# EasyEDA Pro project EasyEDA.epro, schematic Schematic1

## Sheets
1 P1: Board Name: Board1; Create Date: 2025-09-26; Page Name: P1; Project Name: V3s_SBC; Schematic Name: Schematic1; Update Date: 2025-11-04; Company: EasyEDA.com; Page Size: A4; Version: V1.0
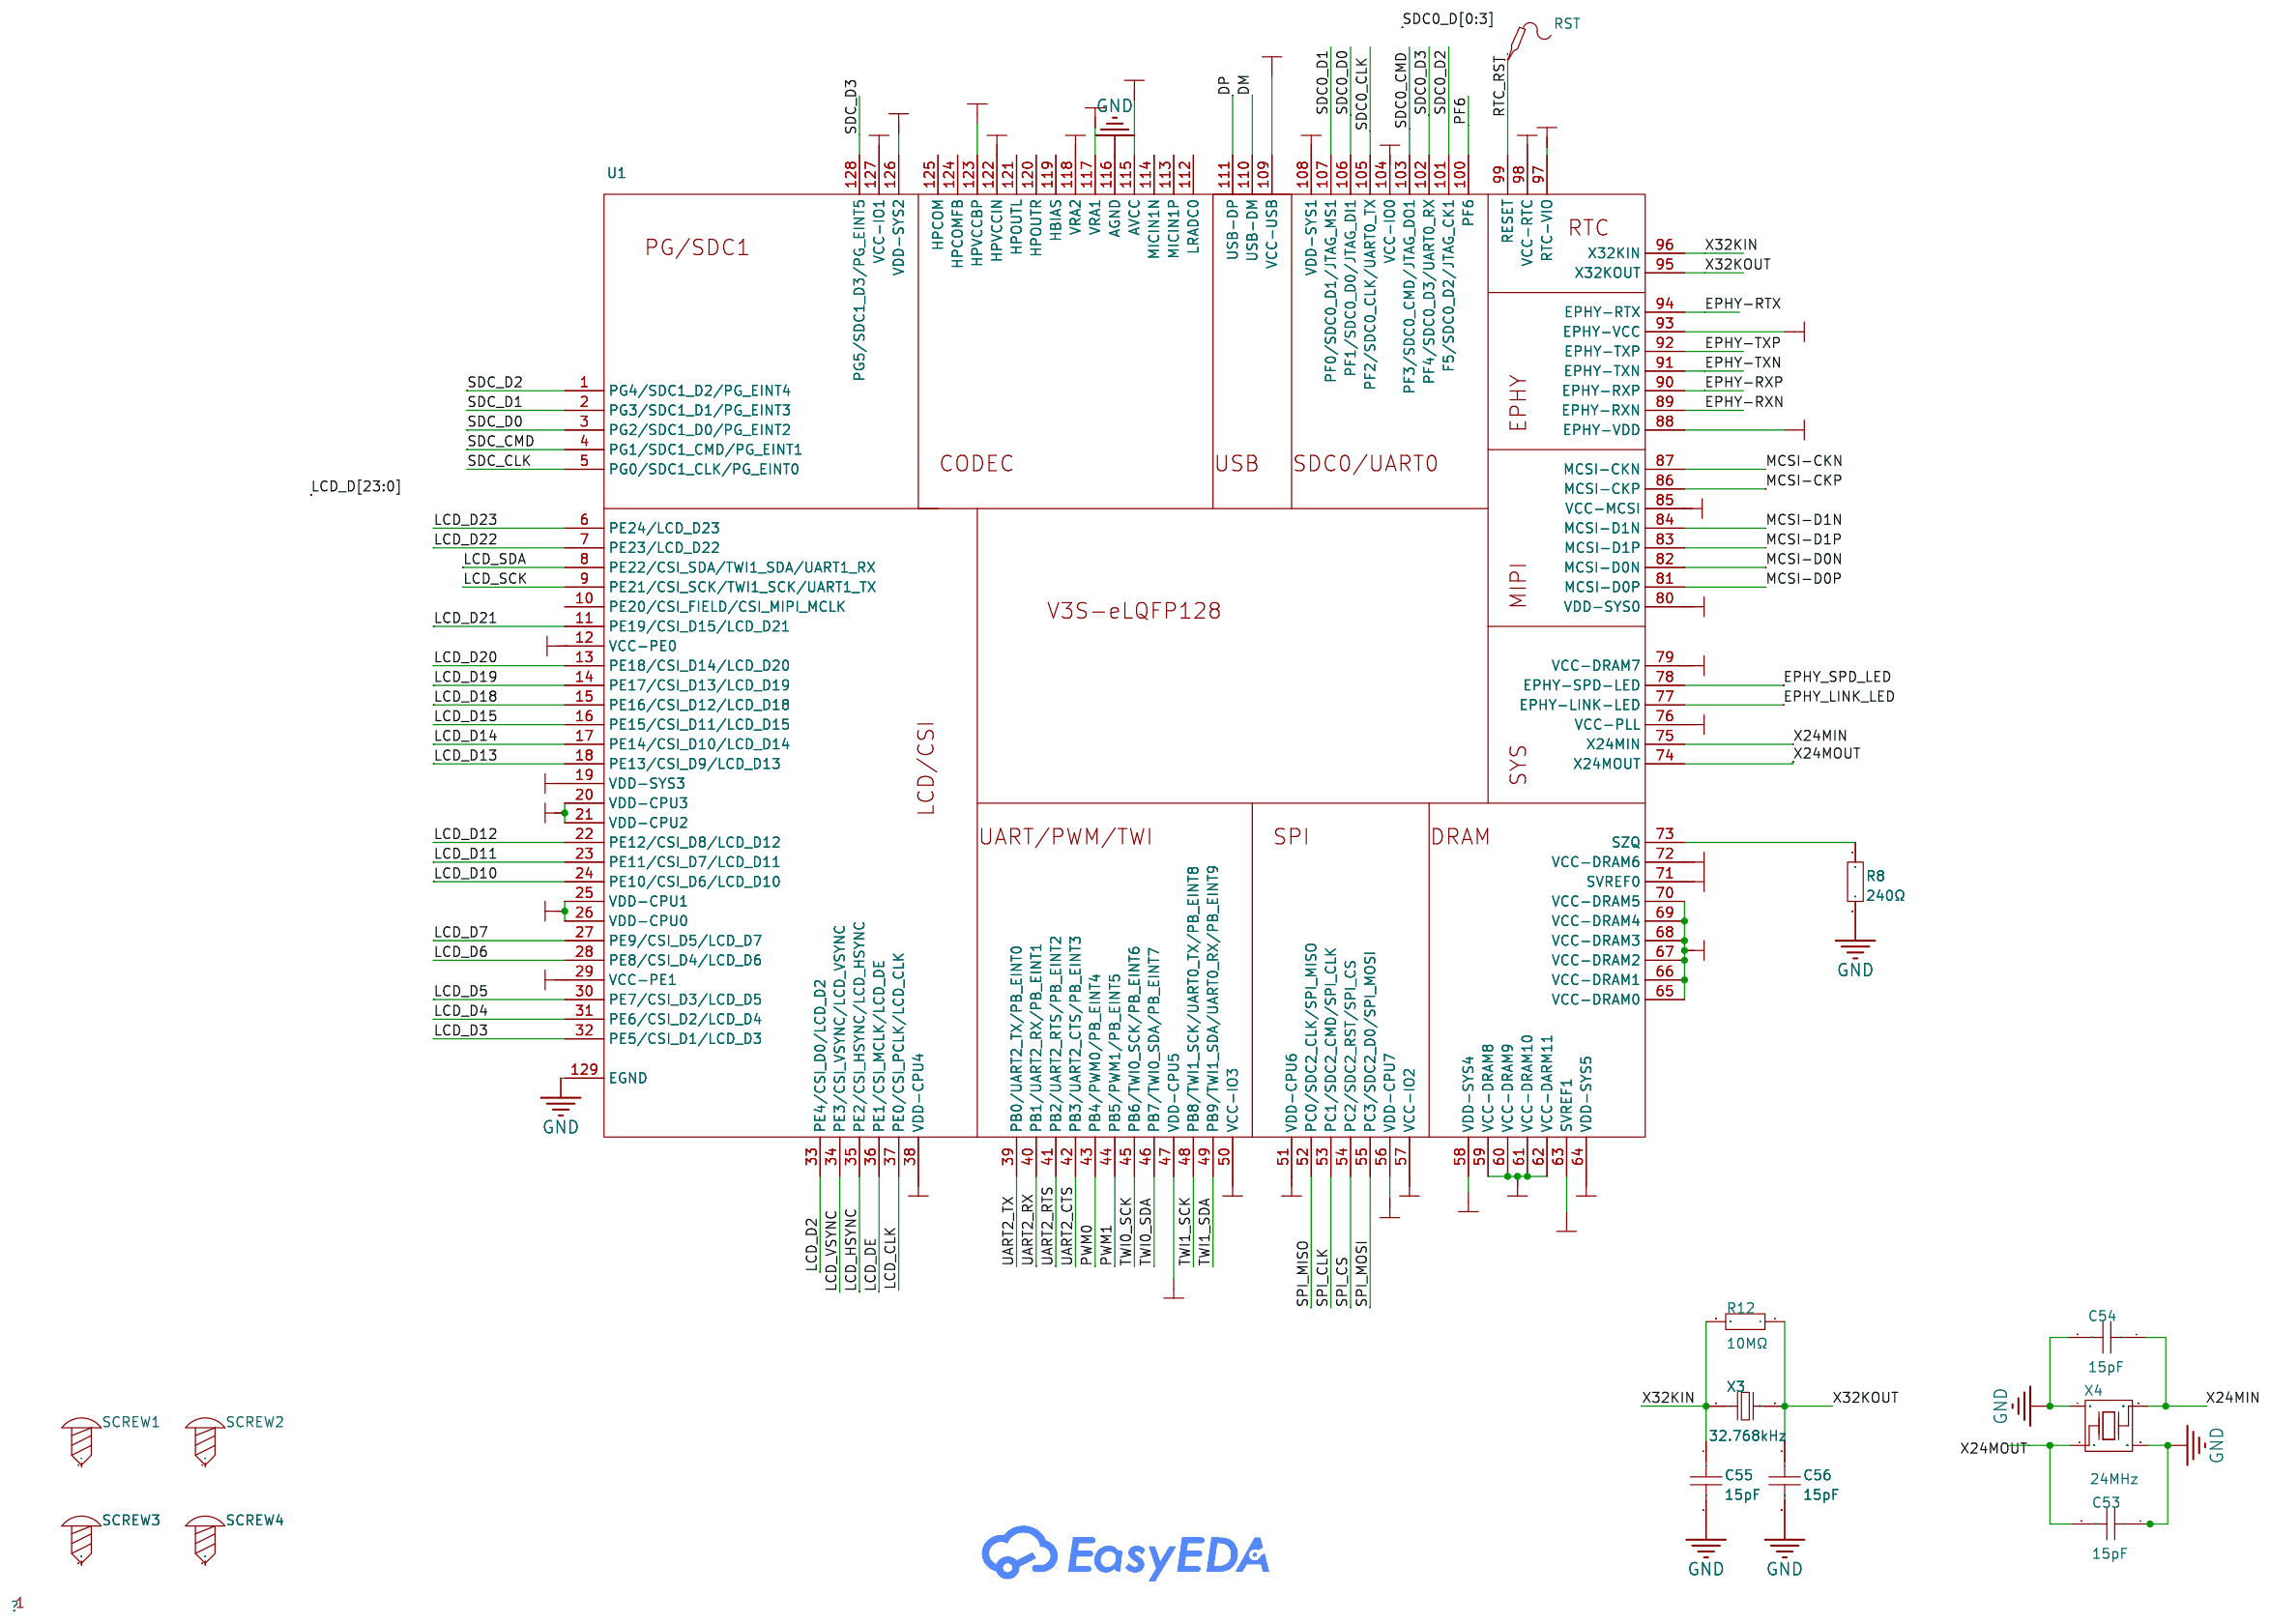
[diagram p0: P1]
2 POWER: Page Name: POWER; Update Date: 2025-11-14
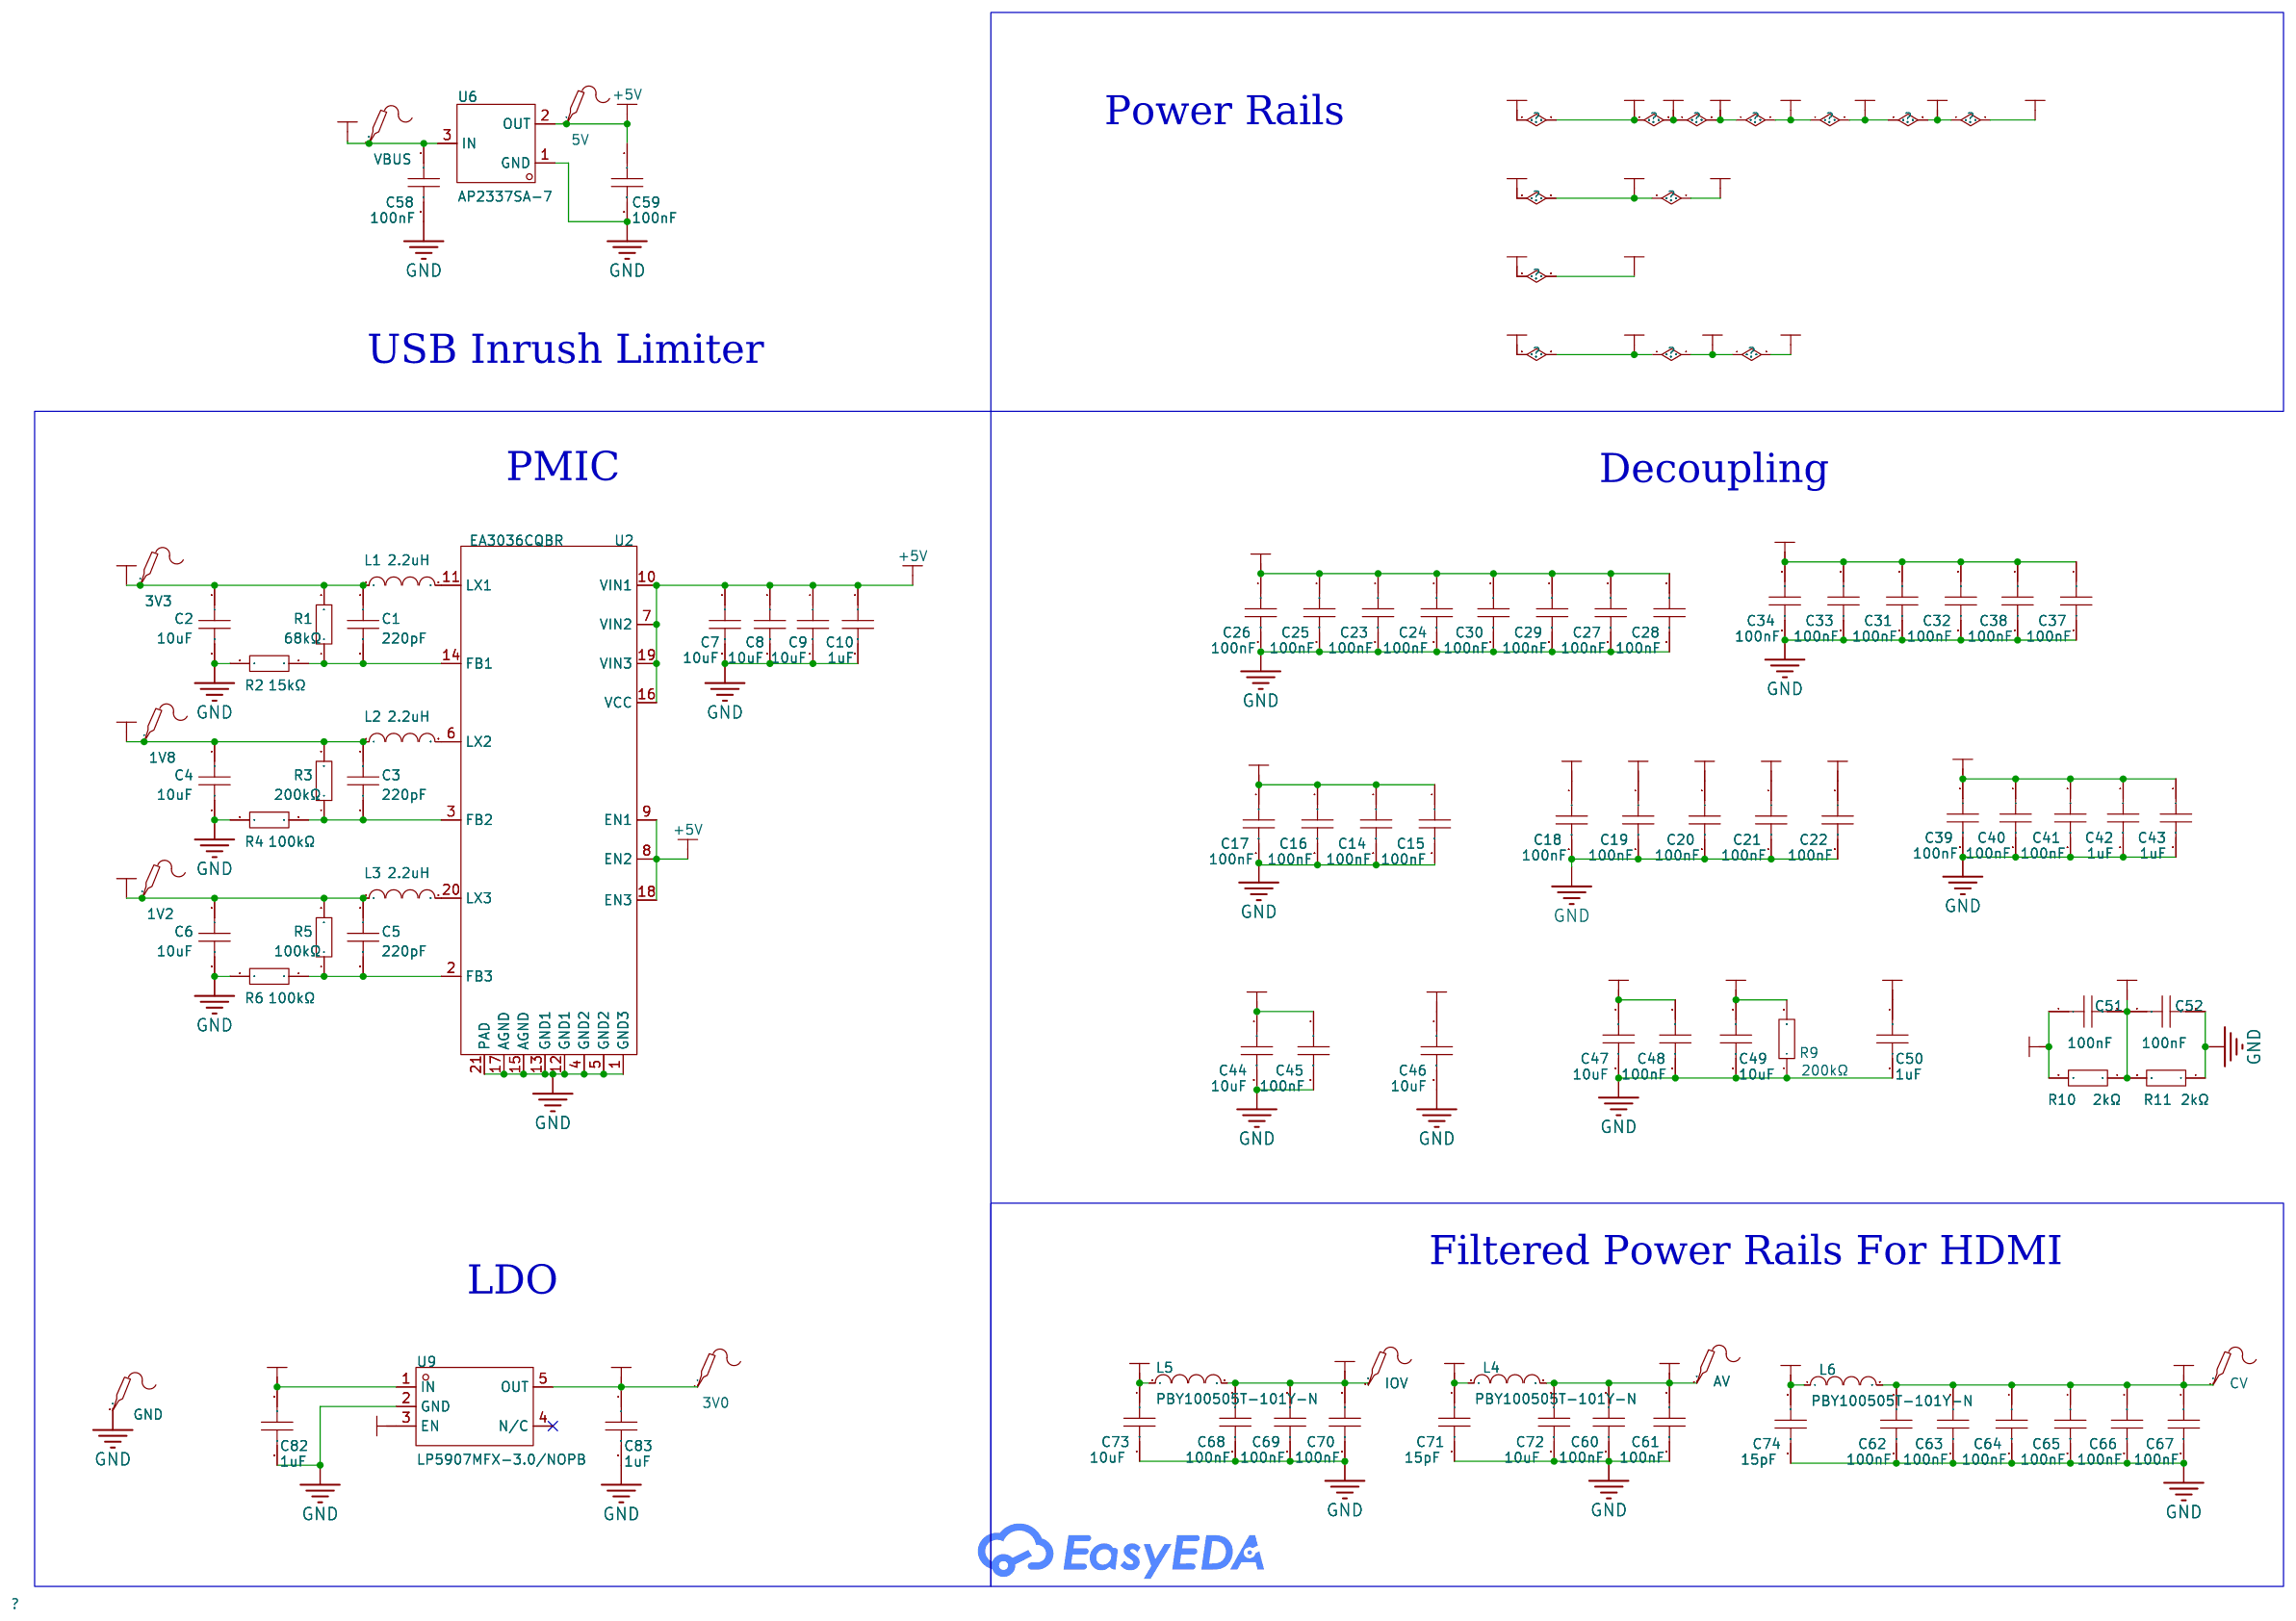
[diagram p1: POWER]
3 PERIPHERALS: Create Date: 2025-10-03; Page Name: PERIPHERALS
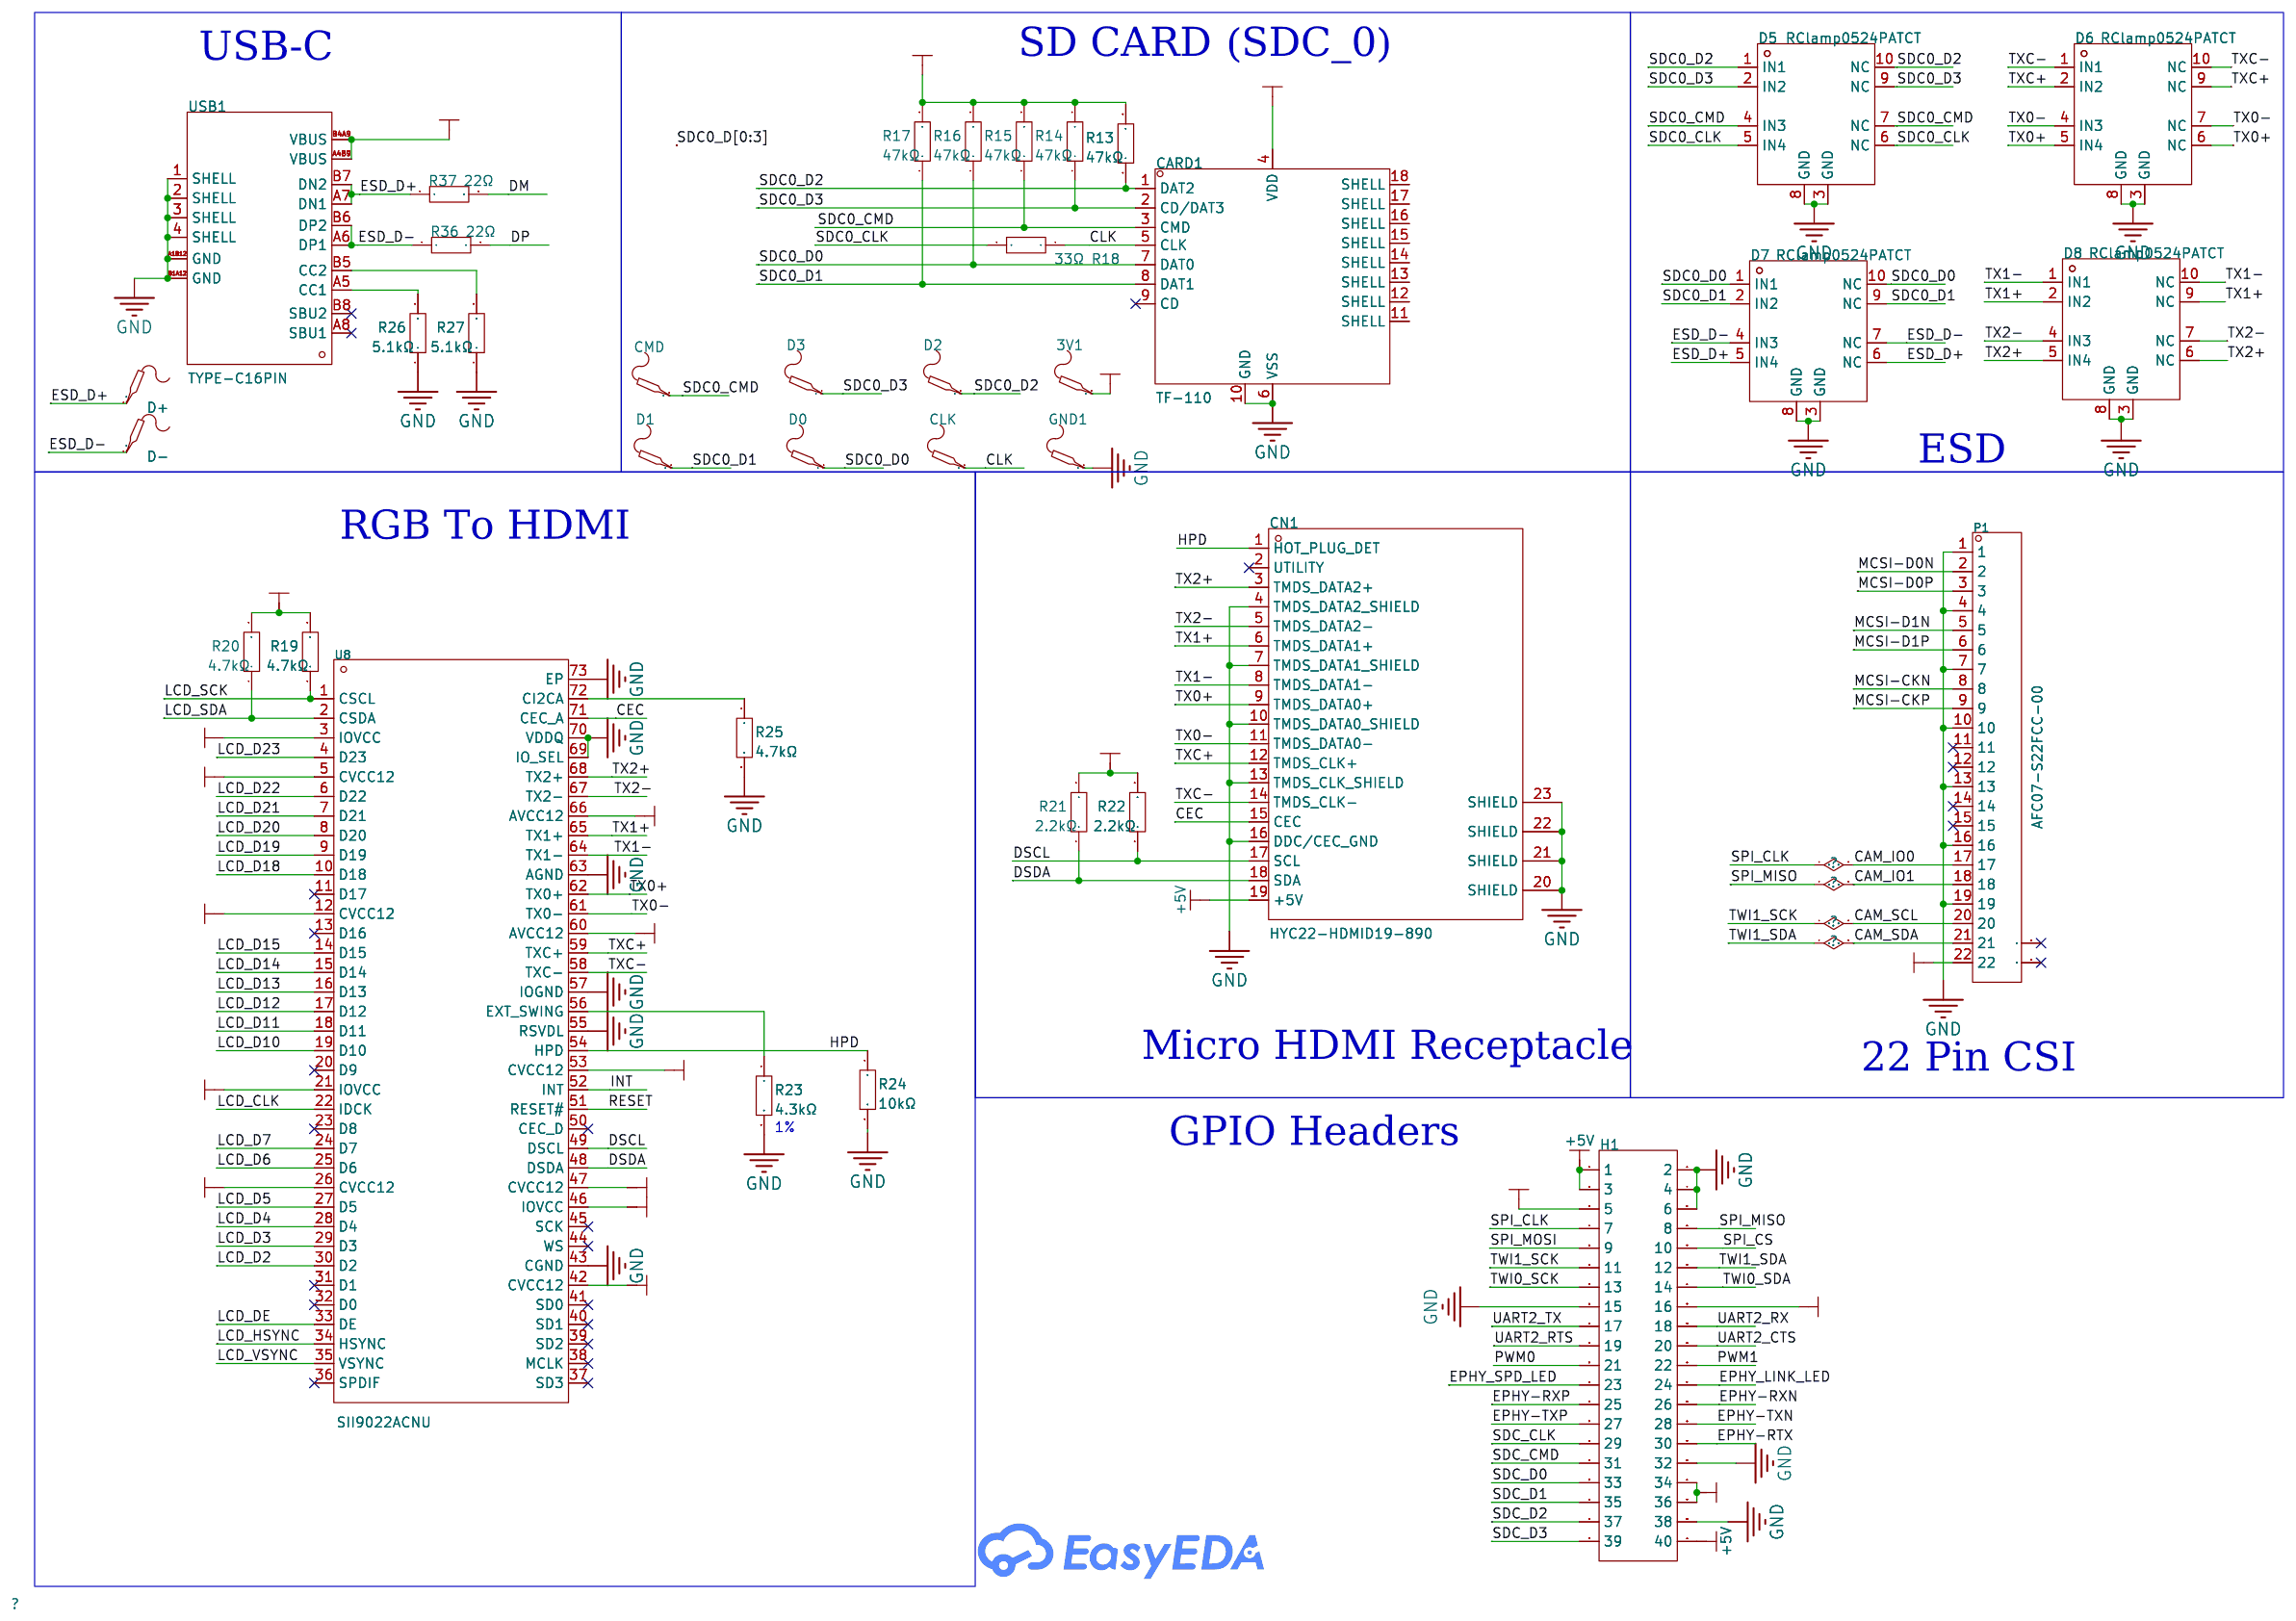
[diagram p2: PERIPHERALS]

## Parts
sheet P1
C53  15pF  [C0201]
C54  15pF  [C0201]
C55  15pF  [C0201]
C56  15pF  [C0201]
R8  240Ω  [R0201]
R12  10MΩ  [R0201]
RST  -  [Test-Point-0.5mm]  (no BOM)
SCREW1  -  [Screw-Hole-M2]  (no BOM)
SCREW2  -  [Screw-Hole-M2]  (no BOM)
SCREW3  -  [Screw-Hole-M2]  (no BOM)
SCREW4  -  [Screw-Hole-M2]  (no BOM)
U1  V3s  [LQFP-128_L14.0-W14.0-P0.40-LS16.0-BL-EP5.0]
X3  32.768kHz  [FC-12M_L2.0-W1.2]
X4  24MHz  [CRYSTAL-SMD_4P-L1.6-W1.2-BL]
sheet PERIPHERALS
3V1  -  [Test-Point-0.5mm]  (no BOM)
CARD1  TF-110  [TF-SMD_TF-110]
CLK  -  [Test-Point-0.5mm]  (no BOM)
CMD  -  [Test-Point-0.5mm]  (no BOM)
CN1  HYC22-HDMID19-890  [HDMI-SMD_HYC22-HDMID19-890]
D0  -  [Test-Point-0.5mm]  (no BOM)
D1  -  [Test-Point-0.5mm]  (no BOM)
D2  -  [Test-Point-0.5mm]  (no BOM)
D3  -  [Test-Point-0.5mm]  (no BOM)
D5  RClamp0524PATCT  [SLP2510P8_L2.5-W1.0-P0.50-BL]
D6  RClamp0524PATCT  [SLP2510P8_L2.5-W1.0-P0.50-BL]
D7  RClamp0524PATCT  [SLP2510P8_L2.5-W1.0-P0.50-BL]
D8  RClamp0524PATCT  [SLP2510P8_L2.5-W1.0-P0.50-BL]
D+  -  [Test-Point-0.5mm]  (no BOM)
D-  -  [Test-Point-0.5mm]  (no BOM)
GND1  -  [Test-Point-0.5mm]  (no BOM)
H1  2.54mm 2*20P直排针  [HDR-TH_40P-P2.54-V-M-R2-C20-S2.54]
P1  AFC07-S22FCC-00  [FPC-SMD_AFC07-S22FCC-00]
R13  47kΩ  [R0201]
R14  47kΩ  [R0201]
R15  47kΩ  [R0201]
R16  47kΩ  [R0201]
R17  47kΩ  [R0201]
R18  33Ω  [R0201]
R19  4.7kΩ  [R0201]
R20  4.7kΩ  [R0201]
R21  2.2kΩ  [R0201]
R22  2.2kΩ  [R0201]
R23  4.3kΩ  [R0201]
R24  10kΩ  [R0201]
R25  4.7kΩ  [R0201]
R26  5.1kΩ  [R0201]
R27  5.1kΩ  [R0201]
R36  22Ω  [R0201]
R37  22Ω  [R0201]
U8  SII9022ACNU  [QFN-72_L10.0-W10.0-P0.50-BL-EP]
USB1  TYPE-C16PIN  [USB-C-SMD_TYPE-C16PIN]
sheet POWER
1V2  -  [Test-Point-0.5mm]  (no BOM)
1V8  -  [Test-Point-0.5mm]  (no BOM)
3V0  -  [Test-Point-0.5mm]  (no BOM)
3V3  -  [Test-Point-0.5mm]  (no BOM)
5V  -  [Test-Point-0.5mm]  (no BOM)
AV  -  [Test-Point-0.5mm]  (no BOM)
C1  220pF  [C0201]
C2  10uF  [C0402]
C3  220pF  [C0201]
C4  10uF  [C0402]
C5  220pF  [C0201]
C6  10uF  [C0402]
C7  10uF  [C0402]
C8  10uF  [C0402]
C9  10uF  [C0402]
C10  1uF  [C0201]
C14  100nF  [C0201]
C15  100nF  [C0201]
C16  100nF  [C0201]
C17  100nF  [C0201]
C18  100nF  [C0201]
C19  100nF  [C0201]
C20  100nF  [C0201]
C21  100nF  [C0201]
C22  100nF  [C0201]
C23  100nF  [C0201]
C24  100nF  [C0201]
C25  100nF  [C0201]
C26  100nF  [C0201]
C27  100nF  [C0201]
C28  100nF  [C0201]
C29  100nF  [C0201]
C30  100nF  [C0201]
C31  100nF  [C0201]
C32  100nF  [C0201]
C33  100nF  [C0201]
C34  100nF  [C0201]
C37  100nF  [C0201]
C38  100nF  [C0201]
C39  100nF  [C0201]
C40  100nF  [C0201]
C41  100nF  [C0201]
C42  1uF  [C0201]
C43  1uF  [C0201]
C44  10uF  [C0402]
C45  100nF  [C0201]
C46  10uF  [C0402]
C47  10uF  [C0402]
C48  100nF  [C0201]
C49  10uF  [C0402]
C50  1uF  [C0201]
C51  100nF  [C0201]
C52  100nF  [C0201]
C58  100nF  [C0201]
C59  100nF  [C0201]
C60  100nF  [C0201]
C61  100nF  [C0201]
C62  100nF  [C0201]
C63  100nF  [C0201]
C64  100nF  [C0201]
C65  100nF  [C0201]
C66  100nF  [C0201]
C67  100nF  [C0201]
C68  100nF  [C0201]
C69  100nF  [C0201]
C70  100nF  [C0201]
C71  15pF  [C0201]
C72  10uF  [C0402]
C73  10uF  [C0402]
C74  15pF  [C0201]
C82  1uF  [C0201]
C83  1uF  [C0201]
CV  -  [Test-Point-0.5mm]  (no BOM)
GND  -  [Test-Point-0.5mm]  (no BOM)
IOV  -  [Test-Point-0.5mm]  (no BOM)
L1  2.2uH  [IND-SMD_L2.0-W1.2_FTC201210S]
L2  2.2uH  [IND-SMD_L2.0-W1.2_FTC201210S]
L3  2.2uH  [IND-SMD_L2.0-W1.2_FTC201210S]
L4  PBY100505T-101Y-N  [L0402]
L5  PBY100505T-101Y-N  [L0402]
L6  PBY100505T-101Y-N  [L0402]
R1  68kΩ  [R0201]
R2  15kΩ  [R0201]
R3  200kΩ  [R0201]
R4  100kΩ  [R0201]
R5  100kΩ  [R0201]
R6  100kΩ  [R0201]
R9  200kΩ  [R0201]
R10  2kΩ  [R0201]
R11  2kΩ  [R0201]
U2  EA3036CQBR  [WQFN-20_L3.0-W3.0-P0.40-BL-EP]
U6  AP2337SA-7  [SOT-23-3_L2.9-W1.3-P1.90-LS2.4-BR]
U9  LP5907MFX-3.0/NOPB  [SOT-23-5_L3.0-W1.7-P0.95-LS2.8-BL]
VBUS  -  [Test-Point-0.5mm]  (no BOM)

## Library data of the parts
C53-C56 C71 C74 = GRM0335C1H150JA01D: Capacitance:15pF Tolerance:±5% Tolerance:±5% Voltage Rating:50V Temperature Coefficient:C0G; LCSC Part Name: 15pF ±5% 50V; Supplier Part: C85891; Manufacturer: muRata(村田); Supplier Footprint: 0201; JLCPCB Part Class: Extended Part; Datasheet: https://item.szlcsc.com/datasheet/GRM0335C1H150JA01D/87067.html; Supplier: LCSC; Tolerance: ±5%; Voltage Rating: 50V; Temperature Coefficient: C0G
R8 = 0201WMF2400TEE: Type:Thick Film Resistor Resistance:240Ω Tolerance:±1% Tolerance:±1% Power(Watts):50mW Voltage-Supply(Max):25V Temperature Coefficient:±200ppm/℃ Temperature Coefficient:±200ppm/℃ Operating Temperature:-55℃~+155℃ Operating Temperature:-55℃~+155℃; LCSC Part Name: 240Ω ±1% 50mW 厚膜电阻; Supplier Part: C270354; Manufacturer: UNI-ROYAL(厚声); Supplier Footprint: 0201; JLCPCB Part Class: Extended Part; Datasheet: https://item.szlcsc.com/datasheet/0201WMF2400TEE/259884.html; Supplier: LCSC; Type: Thick Film Resistor; Tolerance: ±1%; Power(Watts): 50mW; Voltage-Supply(Max): 25V; Temperature Coefficient: ±200ppm/℃; Operating Temperature: -55℃~+155℃
R12 = 0201WMF1005TEE: Type:Thick Film Resistor Resistance:10MΩ Tolerance:±1% Tolerance:±1% Power(Watts):50mW Voltage-Supply(Max):25V Temperature Coefficient:±200ppm/℃ Temperature Coefficient:±200ppm/℃ Operating Temperature:-55℃~+155℃ Operating Temperature:-55℃~+155℃; LCSC Part Name: 10MΩ ±1% 50mW 厚膜电阻; Supplier Part: C423797; Manufacturer: UNI-ROYAL(厚声); Supplier Footprint: 0201; JLCPCB Part Class: Extended Part; Datasheet: https://item.szlcsc.com/datasheet/0201WMF1005TEE/416747.html; Supplier: LCSC; Type: Thick Film Resistor; Tolerance: ±1%; Power(Watts): 50mW; Voltage-Supply(Max): 25V; Temperature Coefficient: ±200ppm/℃; Operating Temperature: -55℃~+155℃
1V2 1V8 3V0 3V1 3V3 5V AV CLK CMD CV D0-D3 D+ D- GND GND1 IOV RST VBUS = Test-Point: Test Point 测试点
SCREW1-SCREW4 = Screw-Hole-M2: Supplier Footprint: 插件
U1 = V3s: CPU Core:-; LCSC Part Name: Allwinner V3s; Supplier Part: C2687449; Manufacturer: Allwinner(全志); Supplier Footprint: LQFP-128-EP(14x14); Supplier: LCSC
X3 = X1A0000610002: Type:Crystal Oscillator Frequency:32.768kHz Normal temperature Frequency Tolerance:±20ppm Normal temperature Frequency Tolerance:±20ppm Load Capacitance:12.5pF Equivalent Series Resistance(ESR):90kΩ Operating Temperature:-40℃~+85℃ Operating Temperature:-4; LCSC Part Name: 32.768kHz ±20ppm 12.5pF; Supplier Part: C55208; Manufacturer: EPSON(爱普生); Supplier Footprint: SMD2012-2P; Datasheet: https://item.szlcsc.com/datasheet/X1A0000610002/56234.html; Supplier: LCSC; Type: Crystal Oscillator; Normal temperature Frequency Tolerance: ±20ppm; Load Capacitance: 12.5pF; Equivalent Series Resistance(ESR): 90kΩ; Operating Temperature: -40℃~+85℃
X4 = 7R24000E12UBE: Type:Crystal Oscillator Frequency:24MHz Normal temperature Frequency Tolerance:±10ppm Normal temperature Frequency Tolerance:±10ppm Load Capacitance:12pF Frequency Stability:±30ppm Frequency Stability:±30ppm Operating Temperature:-20℃~+70℃ Operating Tempe; LCSC Part Name: 24MHz ±10ppm 12pF; Supplier Part: C252278; Manufacturer: SJK(晶科鑫); Supplier Footprint: SMD1612-4P; JLCPCB Part Class: Extended Part; Datasheet: https://item.szlcsc.com/datasheet/7R24000E12UBE/247453.html; Supplier: LCSC; Type: Crystal Oscillator; Normal temperature Frequency Tolerance: ±10ppm; Load Capacitance: 12pF; Frequency Stability: ±30ppm; Operating Temperature: -20℃~+70℃
CARD1 = TF-110: Card Connection Mode:Push-Pull Card Type:MicroSD Card (TF Card) Connector Type:Connector and Ejector Additional Card Detection Pins:- Supplementary Features:- Height Above Board:1.32mm Operating Temperature:-45℃~+85℃ Operating Temperature:-45℃~+85℃; LCSC Part Name: 拔插式 MicroSD卡(TF卡) 卡座; Supplier Part: C266613; Manufacturer: XUNPU(讯普); Supplier Footprint: SMD; Datasheet: https://item.szlcsc.com/datasheet/TF-110/256968.html; Supplier: LCSC; Card Connection Mode: Push-Pull; Card Type: MicroSD Card (TF Card); Connector Type: Connector and Ejector; Height Above Board: 1.32mm; Operating Temperature: -45℃~+85℃
CN1 = HYC22-HDMID19-890: Connector Type:HDMI-D Gender:Mother Number of Pins:19P Mounting Style:Horizontal attachment Current Rating (Max):0.5A Rated Voltage (Max):40V Operating Temperature Range:-20℃~+85℃ Operating Temperature Range:-20℃~+85℃; Supplier Part: C711356; Manufacturer: 华宇创; Supplier Footprint: SMD; Datasheet: https://atta.szlcsc.com/upload/public/pdf/source/20200812/C711356_796A915A627521E4742B63608531C3C9.pdf; Supplier: LCSC; Connector Type: HDMI-D; Gender: Mother; Number of Pins: 19P; Mounting Style: Horizontal attachment; Current Rating (Max): 0.5A; Rated Voltage (Max): 40V; Operating Temperature Range: -20℃~+85℃
D5-D8 = RClamp0524PATCT_C40960: Reverse Stand-Off Voltage (Vrwm):5V Clamping Voltage:15V Peak Pulse Current (Ipp):5A@8/20us Peak Pulse Power Dissipation (Ppp):150W Voltage - Breakdown:6V Reverse Leakage Current (Ir):1uA Number of Channels:4 Operating Temperature:-55℃~+125℃@(Tj) Operatin; LCSC Part Name: ESD 5V截止 峰值浪涌电流：5A@8/20us; Supplier Part: C40960; Manufacturer: SEMTECH; Supplier Footprint: DFN-10(1x2.5); JLCPCB Part Class: Extended Part; Datasheet: https://item.szlcsc.com/datasheet/RClamp0524PATCT/41944.html; Supplier: LCSC; Reverse Stand-Off Voltage (Vrwm): 5V; Clamping Voltage: 15V; Peak Pulse Current (Ipp): 5A@8/20us; Peak Pulse Power Dissipation (Ppp): 150W; Voltage - Breakdown: 6V; Reverse Leakage Current (Ir): 1uA; Number of Channels: 4; Operating Temperature: -55℃~+125℃@(Tj); level of protection: IEC 61000-4-4；IEC 61000-4-5；IEC 61000-4-2; Type: ESD; Junction Capacitance: 0.3pF
H1 = 2.54mm 2*20P直排针: Pin Structure:2x20P Pitch:2.54mm Row Spacing:2.54mm Circluar Pins/Square Pins:Policy Mounting Type:Straight Number of Rows:Double Row Number of Pins:40P Current Rating:3A Voltage Rating (Max):- Length of Mating Pin:6mm Insulation Height:- Length of End Co; LCSC Part Name: 2x20P 间距:2.54mm 方针 直插; Supplier Part: C50980; Manufacturer: BOOMELE(博穆精密); Supplier Footprint: 插件,P=2.54mm; Datasheet: https://atta.szlcsc.com/upload/public/pdf/source/20151109/1457707572823.pdf; Supplier: LCSC; Pin Structure: 2x20P; Pitch: 2.54mm; Row Spacing: 2.54mm; Circluar Pins/Square Pins: Policy; Mounting Type: Straight; Number of Rows: Double Row; Number of Pins: 40P; Current Rating: 3A; Length of Mating Pin: 6mm; Length of End Connection Pin: 3mm; Contact Material: Brass; Operating Temperature: -40℃~+105℃; Color: Black
P1 = AFC07-S22FCC-00: Locking Feature:Slide Lock Contact Type:Bottom Contact Number of Contacts:22P Pitch:0.5mm Mounting Type:Surface Mount, Right Angle FFC, FCB Thickness:0.3mm FFC, FCB Thickness:0.3mm Height Above Board:2mm; LCSC Part Name: 间距:0.5mm P数:22P 抽屉式 下接; Supplier Part: C11056; Manufacturer: JS(钜硕电子); Supplier Footprint: SMD,P=0.5mm,卧贴; Datasheet: https://item.szlcsc.com/datasheet/AFC07-S22FCC-00/11603.html; Supplier: LCSC; Locking Feature: Slide Lock; Contact Type: Bottom Contact; Number of Contacts: 22P; Pitch: 0.5mm; Mounting Type: Surface Mount, Right Angle; FFC, FCB Thickness: 0.3mm; Height Above Board: 2mm
R13-R17 = 0201WMF4702TEE: Type:Thick Film Resistor Resistance:47kΩ Tolerance:±1% Tolerance:±1% Power(Watts):50mW Voltage-Supply(Max):25V Temperature Coefficient:±200ppm/℃ Temperature Coefficient:±200ppm/℃ Operating Temperature:-55℃~+155℃ Operating Temperature:-55℃~+155℃; LCSC Part Name: 47kΩ ±1% 50mW 厚膜电阻; Supplier Part: C270345; Manufacturer: UNI-ROYAL(厚声); Supplier Footprint: 0201; JLCPCB Part Class: Extended Part; Datasheet: https://item.szlcsc.com/datasheet/0201WMF4702TEE/259875.html; Supplier: LCSC; Type: Thick Film Resistor; Tolerance: ±1%; Power(Watts): 50mW; Voltage-Supply(Max): 25V; Temperature Coefficient: ±200ppm/℃; Operating Temperature: -55℃~+155℃
R18 = 0201WMF330JTEE: Type:Thick Film Resistor Resistance:33Ω Tolerance:±1% Tolerance:±1% Power(Watts):50mW Voltage-Supply(Max):25V Temperature Coefficient:±200ppm/℃ Temperature Coefficient:±200ppm/℃ Operating Temperature:-55℃~+155℃ Operating Temperature:-55℃~+155℃; LCSC Part Name: 33Ω ±1% 50mW 厚膜电阻; Supplier Part: C473457; Manufacturer: UNI-ROYAL(厚声); Supplier Footprint: 0201; JLCPCB Part Class: Extended Part; Datasheet: https://item.szlcsc.com/datasheet/0201WMF330JTEE/479850.html; Supplier: LCSC; Type: Thick Film Resistor; Tolerance: ±1%; Power(Watts): 50mW; Voltage-Supply(Max): 25V; Temperature Coefficient: ±200ppm/℃; Operating Temperature: -55℃~+155℃
R19 R20 R25 = 0201WMF4701TEE: Type:Thick Film Resistor Resistance:4.7kΩ Tolerance:±1% Tolerance:±1% Power(Watts):50mW Voltage-Supply(Max):25V Temperature Coefficient:±200ppm/℃ Temperature Coefficient:±200ppm/℃ Operating Temperature:-55℃~+155℃ Operating Temperature:-55℃~+155℃; LCSC Part Name: 4.7kΩ ±1% 50mW 厚膜电阻; Supplier Part: C270346; Manufacturer: UNI-ROYAL(厚声); Supplier Footprint: 0201; JLCPCB Part Class: Extended Part; Datasheet: https://item.szlcsc.com/datasheet/0201WMF4701TEE/259876.html; Supplier: LCSC; Type: Thick Film Resistor; Tolerance: ±1%; Power(Watts): 50mW; Voltage-Supply(Max): 25V; Temperature Coefficient: ±200ppm/℃; Operating Temperature: -55℃~+155℃
R21 R22 = 0201WMF2201TEE: Type:Thick Film Resistor Resistance:2.2kΩ Tolerance:±1% Tolerance:±1% Power(Watts):50mW Voltage-Supply(Max):25V Temperature Coefficient:±200ppm/℃ Temperature Coefficient:±200ppm/℃ Operating Temperature:-55℃~+155℃ Operating Temperature:-55℃~+155℃; LCSC Part Name: 2.2kΩ ±1% 50mW 厚膜电阻; Supplier Part: C473508; Manufacturer: UNI-ROYAL(厚声); Supplier Footprint: 0201; JLCPCB Part Class: Extended Part; Datasheet: https://item.szlcsc.com/datasheet/0201WMF2201TEE/479901.html; Supplier: LCSC; Type: Thick Film Resistor; Tolerance: ±1%; Power(Watts): 50mW; Voltage-Supply(Max): 25V; Temperature Coefficient: ±200ppm/℃; Operating Temperature: -55℃~+155℃
R23 = 0201WMF4301TEE: Type:Thick Film Resistor Resistance:4.3kΩ Tolerance:±1% Tolerance:±1% Power(Watts):50mW Voltage-Supply(Max):25V Temperature Coefficient:±200ppm/℃ Temperature Coefficient:±200ppm/℃ Operating Temperature:-55℃~+155℃ Operating Temperature:-55℃~+155℃; LCSC Part Name: 4.3kΩ ±1% 50mW 厚膜电阻; Supplier Part: C423525; Manufacturer: UNI-ROYAL(厚声); Supplier Footprint: 0201; JLCPCB Part Class: Extended Part; Datasheet: https://item.szlcsc.com/datasheet/0201WMF4301TEE/416475.html; Supplier: LCSC; Type: Thick Film Resistor; Tolerance: ±1%; Power(Watts): 50mW; Voltage-Supply(Max): 25V; Temperature Coefficient: ±200ppm/℃; Operating Temperature: -55℃~+155℃
R24 = 0201WMF1002TEE: Type:Thick Film Resistors Resistance:10kΩ Tolerance:±1% Tolerance:±1% Power(Watts): Overload Voltage (Max): Temperature Coefficient:±200ppm/℃ Temperature Coefficient:±200ppm/℃ Operating Temperature Range:-55℃~+155℃ Operating Temperature Range:-55℃~+155℃; LCSC Part Name: 10kΩ ±1% 50mW 厚膜电阻; Supplier Part: C473048; Manufacturer: UNI-ROYAL(厚声); Supplier Footprint: 0201; JLCPCB Part Class: Extended Part; Datasheet: https://atta.szlcsc.com/upload/public/pdf/source/20200306/C422600_1E6D84923E4A46A82E41ADD87F860B5C.pdf; Supplier: LCSC; Type: Thick Film Resistors; Tolerance: ±1%; Temperature Coefficient: ±200ppm/℃; Operating Temperature Range: -55℃~+155℃
R26 R27 = 0201WMF5101TEE: Type:Thick Film Resistor Resistance:5.1kΩ Tolerance:±1% Tolerance:±1% Power(Watts):50mW Voltage-Supply(Max):25V Temperature Coefficient:±200ppm/℃ Temperature Coefficient:±200ppm/℃ Operating Temperature:-55℃~+155℃ Operating Temperature:-55℃~+155℃; LCSC Part Name: 5.1kΩ ±1% 50mW 厚膜电阻; Supplier Part: C270344; Manufacturer: UNI-ROYAL(厚声); Supplier Footprint: 0201; JLCPCB Part Class: Extended Part; Datasheet: https://item.szlcsc.com/datasheet/0201WMF5101TEE/259874.html; Supplier: LCSC; Type: Thick Film Resistor; Tolerance: ±1%; Power(Watts): 50mW; Voltage-Supply(Max): 25V; Temperature Coefficient: ±200ppm/℃; Operating Temperature: -55℃~+155℃
R36 R37 = 0201WMF220JTEE: Type:Thick Film Resistor Resistance:22Ω Tolerance:±1% Tolerance:±1% Power(Watts):50mW Voltage-Supply(Max):25V Temperature Coefficient:±200ppm/℃ Temperature Coefficient:±200ppm/℃ Operating Temperature:-55℃~+155℃ Operating Temperature:-55℃~+155℃; LCSC Part Name: 22Ω ±1% 50mW 厚膜电阻; Supplier Part: C270355; Manufacturer: UNI-ROYAL(厚声); Supplier Footprint: 0201; JLCPCB Part Class: Extended Part; Datasheet: https://item.szlcsc.com/datasheet/0201WMF220JTEE/259885.html; Supplier: LCSC; Type: Thick Film Resistor; Tolerance: ±1%; Power(Watts): 50mW; Voltage-Supply(Max): 25V; Temperature Coefficient: ±200ppm/℃; Operating Temperature: -55℃~+155℃
U8 = SII9022ACNU_C369565: Type:Transmitter Control Interface:I2S；I2C Data Rate:- Voltage - Supply:1.08V~3.6V Voltage - Supply:1.08V~3.6V Operating Temperature:- Operating Temperature:-; LCSC Part Name: HDMI发射机; Supplier Part: C369565; Manufacturer: LATTICE(莱迪思); Supplier Footprint: QFN-72-EP(10x10); Datasheet: https://item.szlcsc.com/datasheet/SII9022ACNU/343367.html; Supplier: LCSC; Type: Transmitter; Control Interface: I2S；I2C; Voltage - Supply: 1.08V~3.6V
USB1 = TYPE-C16PIN: Connector Type:Type-C Protocol Standard:USB 3.1 Gender:Female Mounting Type:Surface Mount, Right Angle Number of Contacts:16P Number of Ports:1 Current Rating-Power:3A Voltage Rating:30V Connect-Disconnect Life:10,000 Cycles Detection color:Black Operatin; LCSC Part Name: Type-C 母 卧贴; Supplier Part: C393939; Manufacturer: SHOU HAN(首韩); Supplier Footprint: SMD; Datasheet: https://item.szlcsc.com/datasheet/TYPE-C16PIN/372551.html; Supplier: LCSC; Connector Type: Type-C; Protocol Standard: USB 3.1; Gender: Female; Mounting Type: Surface Mount, Right Angle; Number of Contacts: 16P; Number of Ports: 1; Current Rating-Power: 3A; Voltage Rating: 30V; Connect-Disconnect Life: 10,000 Cycles; Detection color: Black; Operating Temperature: -40℃~+85℃
C1 C3 C5 = GRM0335C1E221JA01D: Capacitance: Tolerance:±5% Tolerance:±5% Voltage Rated: Temperature Coefficient:; LCSC Part Name: 220pF ±5% 25V; Supplier Part: C907939; Manufacturer: muRata(村田); Supplier Footprint: 0201; JLCPCB Part Class: Extended Part; Datasheet: https://atta.szlcsc.com/upload/public/pdf/source/20201022/C907939_9B40B5B9955CBF659B18C3F7E4D40FB5.pdf; Supplier: LCSC; Tolerance: ±5%
C2 C4 C6-C9 C44 C46 C47 C49 C72 C73 = GRM155R61A106ME44D: Capacitance:10uF Tolerance:±20% Tolerance:±20% Voltage Rating:10V Temperature Coefficient:X5R; LCSC Part Name: 10uF ±20% 10V; Supplier Part: C77000; Manufacturer: muRata(村田); Supplier Footprint: 0402; JLCPCB Part Class: Extended Part; Datasheet: https://item.szlcsc.com/datasheet/GRM155R61A106ME44D/78127.html; Supplier: LCSC; Tolerance: ±20%; Voltage Rating: 10V; Temperature Coefficient: X5R
C10 C42 C43 C50 C82 C83 = GRM033R61A105ME44D: Capacitance:1uF Tolerance:±20% Tolerance:±20% Voltage Rating:10V Temperature Coefficient:X5R; LCSC Part Name: 1uF ±20% 10V; Supplier Part: C76935; Manufacturer: muRata(村田); Supplier Footprint: 0201; JLCPCB Part Class: Extended Part; Datasheet: https://item.szlcsc.com/datasheet/GRM033R61A105ME44D/78062.html; Supplier: LCSC; Tolerance: ±20%; Voltage Rating: 10V; Temperature Coefficient: X5R
C14-C34 C37-C41 C45 C48 C51 C52 C58-C70 = GRM033R61A104KE15D: Capacitance: Tolerance:±10% Tolerance:±10% Voltage Rated: Temperature Coefficient:; LCSC Part Name: 100nF ±10% 10V; Supplier Part: C76934; Manufacturer: muRata(村田); Supplier Footprint: 0201; JLCPCB Part Class: Extended Part; Datasheet: https://atta.szlcsc.com/upload/public/pdf/source/20180307/C76934_15204090982891407723.pdf; Supplier: LCSC; Tolerance: ±10%
L1-L3 = FTC201210S2R2MBCA: Inductance: Tolerance:±20% Tolerance:±20% Rated Current:2A Saturation Current (Isat):2.7A DC Resistance (DCR): Type:一体成型电感; LCSC Part Name: 2.2uH ±20% 2.7A; Supplier Part: C5832324; Manufacturer: cjiang(长江微电); Supplier Footprint: SMD,1.2x2mm; JLCPCB Part Class: Extended Part; Datasheet: https://atta.szlcsc.com/upload/public/pdf/source/20230602/8FFEDA9C0247A92A0D4B67554BFE4091.pdf; Supplier: LCSC; Tolerance: ±20%; Rated Current: 2A; Saturation Current (Isat): 2.7A; Type: 一体成型电感
L4-L6 = PBY100505T-101Y-N: Impedance @ Frequency:100Ω@100MHz Tolerance:±25% Tolerance:±25% DC Resistance(DCR):90mΩ Current Rating:1.2A Number of Circuits:1; LCSC Part Name: 单路 0402磁珠 阻抗100Ω@100MHz; Supplier Part: C142087; Manufacturer: Chilisin(奇力新); Supplier Footprint: 0402; JLCPCB Part Class: Extended Part; Datasheet: https://atta.szlcsc.com/upload/public/pdf/source/20190222/C365833_C5BA06A2E8E6F9A0DF6BCCC9B8B79B3E.pdf; Supplier: LCSC; Impedance @ Frequency: 100Ω@100MHz; Tolerance: ±25%; DC Resistance(DCR): 90mΩ; Current Rating: 1.2A; Number of Circuits: 1
R1 = 0201WMF6802TEE: Type:Thick Film Resistor Resistance:68kΩ Tolerance:±1% Tolerance:±1% Power(Watts):50mW Voltage-Supply(Max):25V Temperature Coefficient:±200ppm/℃ Temperature Coefficient:±200ppm/℃ Operating Temperature:-55℃~+155℃ Operating Temperature:-55℃~+155℃; LCSC Part Name: 68kΩ ±1% 50mW 厚膜电阻; Supplier Part: C423450; Manufacturer: UNI-ROYAL(厚声); Supplier Footprint: 0201; JLCPCB Part Class: Extended Part; Datasheet: https://item.szlcsc.com/datasheet/0201WMF6802TEE/416400.html; Supplier: LCSC; Type: Thick Film Resistor; Tolerance: ±1%; Power(Watts): 50mW; Voltage-Supply(Max): 25V; Temperature Coefficient: ±200ppm/℃; Operating Temperature: -55℃~+155℃
R2 = 0201WMF1502TEE: Type:Thick Film Resistor Resistance:15kΩ Tolerance:±1% Tolerance:±1% Power(Watts):50mW Voltage-Supply(Max):25V Temperature Coefficient:±200ppm/℃ Temperature Coefficient:±200ppm/℃ Operating Temperature:-55℃~+155℃ Operating Temperature:-55℃~+155℃; LCSC Part Name: 15kΩ ±1% 50mW 厚膜电阻; Supplier Part: C473452; Manufacturer: UNI-ROYAL(厚声); Supplier Footprint: 0201; JLCPCB Part Class: Extended Part; Datasheet: https://item.szlcsc.com/datasheet/0201WMF1502TEE/479845.html; Supplier: LCSC; Type: Thick Film Resistor; Tolerance: ±1%; Power(Watts): 50mW; Voltage-Supply(Max): 25V; Temperature Coefficient: ±200ppm/℃; Operating Temperature: -55℃~+155℃
R3 R9 = 0201WMF2003TEE: Type:Thick Film Resistor Resistance:200kΩ Tolerance:±1% Tolerance:±1% Power(Watts):50mW Voltage-Supply(Max):25V Temperature Coefficient:±200ppm/℃ Temperature Coefficient:±200ppm/℃ Operating Temperature:-55℃~+155℃ Operating Temperature:-55℃~+155℃; LCSC Part Name: 200kΩ ±1% 50mW 厚膜电阻; Supplier Part: C270357; Manufacturer: UNI-ROYAL(厚声); Supplier Footprint: 0201; JLCPCB Part Class: Extended Part; Datasheet: https://item.szlcsc.com/datasheet/0201WMF2003TEE/259887.html; Supplier: LCSC; Type: Thick Film Resistor; Tolerance: ±1%; Power(Watts): 50mW; Voltage-Supply(Max): 25V; Temperature Coefficient: ±200ppm/℃; Operating Temperature: -55℃~+155℃
R4-R6 = 0201WMF1003TEE: Type:Thick Film Resistors Resistance:100kΩ Tolerance:±1% Tolerance:±1% Power(Watts): Overload Voltage (Max): Temperature Coefficient:±200ppm/℃ Temperature Coefficient:±200ppm/℃ Operating Temperature Range:-55℃~+155℃ Operating Temperature Range:-55℃~+155℃; LCSC Part Name: 100kΩ ±1% 50mW 厚膜电阻; Supplier Part: C270364; Manufacturer: UNI-ROYAL(厚声); Supplier Footprint: 0201; JLCPCB Part Class: Extended Part; Datasheet: https://atta.szlcsc.com/upload/public/pdf/source/20200306/C422600_1E6D84923E4A46A82E41ADD87F860B5C.pdf; Supplier: LCSC; Type: Thick Film Resistors; Tolerance: ±1%; Temperature Coefficient: ±200ppm/℃; Operating Temperature Range: -55℃~+155℃
R10 R11 = 0201WMF2001TEE: Type:Thick Film Resistor Resistance:2kΩ Tolerance:±1% Tolerance:±1% Power(Watts):50mW Voltage-Supply(Max):25V Temperature Coefficient:±200ppm/℃ Temperature Coefficient:±200ppm/℃ Operating Temperature:-55℃~+155℃ Operating Temperature:-55℃~+155℃; LCSC Part Name: 2kΩ ±1% 50mW 厚膜电阻; Supplier Part: C270358; Manufacturer: UNI-ROYAL(厚声); Supplier Footprint: 0201; JLCPCB Part Class: Extended Part; Datasheet: https://item.szlcsc.com/datasheet/0201WMF2001TEE/259888.html; Supplier: LCSC; Type: Thick Film Resistor; Tolerance: ±1%; Power(Watts): 50mW; Voltage-Supply(Max): 25V; Temperature Coefficient: ±200ppm/℃; Operating Temperature: -55℃~+155℃
U2 = EA3036CQBR: LCSC Part Name: EA3036; Supplier Part: C570857; Manufacturer: everanalog(申风); Supplier Footprint: WQFN-20-EP(3x3); Datasheet: https://item.szlcsc.com/datasheet/EA3036CQBR/596623.html; Supplier: LCSC
U6 = AP2337SA-7: Type:Load Switch Number of Channels:1 Control Input Logic:- Maximum Continuous Current:1A Voltage - Supply:2.7V~5.5V Voltage - Supply:2.7V~5.5V RDS(on):110mΩ Operating Temperature	-:-40℃~+85℃ Operating Temperature	-:-40℃~+85℃ Features:Over Temperature Pro; LCSC Part Name: 1.0A单通道限流负载开关; Supplier Part: C150497; Manufacturer: DIODES(美台); Supplier Footprint: SOT-23; Datasheet: https://item.szlcsc.com/datasheet/AP2337SA-7/161835.html; Supplier: LCSC; Type: Load Switch; Number of Channels: 1; Maximum Continuous Current: 1A; Voltage - Supply: 2.7V~5.5V; RDS(on): 110mΩ; Operating Temperature	-: -40℃~+85℃; Features: Over Temperature Protection；Over Voltage Protection；Short-Circuit  Protection(SCP)；Overcurrent Protection(OCP)；Undervoltage Protection(UVP)
U9 = LP5907MFX-3.0/NOPB: Output Type:Fixed Maximum Input Voltage:5.5V Output Voltage:3V Output Voltage:3V Output Current:250mA Power Supply Rejection Ratio (PSRR):90dB Dropout Voltage:250mV@(250mA) standby current:25uA Feature:防静电保护；Short-Circuit  Protection；低ESR；Thermal Protecti; LCSC Part Name: 具有低 IQ 和使能功能的 250mA、低噪声、高 PSRR、超低压降稳压器; Supplier Part: C475492; Manufacturer: TI(德州仪器); Supplier Footprint: SOT-23-5; JLCPCB Part Class: Extended Part; Datasheet: https://www.ti.com/cn/lit/gpn/lp5907; Supplier: LCSC; Output Type: Fixed; Maximum Input Voltage: 5.5V; Output Voltage: 3V; Output Current: 250mA; Power Supply Rejection Ratio (PSRR): 90dB; Dropout Voltage: 250mV@(250mA); standby current: 25uA; Feature: 防静电保护；Short-Circuit  Protection；低ESR；Thermal Protection(TSD)；欠压闭锁；带使能; Operating Temperature: -40℃~+125℃; Output Polarity: Positive electrode; Number of Outputs: 1

## Nets
1V2: 1V2.1 C5.1 C6.1 C23.1 C24.1 C25.1 C26.1 C27.1 C28.1 C29.1 C30.1 C31.1 C32.1 C33.1 C34.1 C37.1 C38.1 C71.1 C74.1 L3.1 L4.1 L6.1 R5.2 U1.19(VDD-SYS3) U1.20(VDD-CPU3) U1.21(VDD-CPU2) U1.25(VDD-CPU1) U1.26(VDD-CPU0) U1.38(VDD-CPU4) U1.47(VDD-CPU5) U1.51(VDD-CPU6) U1.56(VDD-CPU7) U1.58(VDD-SYS4) U1.64(VDD-SYS5) U1.80(VDD-SYS0) U1.88(EPHY-VDD) U1.108(VDD-SYS1) U1.126(VDD-SYS2)
1V8: 1V8.1 C3.1 C4.1 C39.1 C40.1 C41.1 C42.1 C43.1 C51.1 L2.1 R3.2 R10.2 U1.59(VCC-DRAM8) U1.60(VCC-DRAM9) U1.61(VCC-DRAM10) U1.62(VCC-DARM11) U1.65(VCC-DRAM0) U1.66(VCC-DRAM1) U1.67(VCC-DRAM2) U1.68(VCC-DRAM3) U1.69(VCC-DRAM4) U1.70(VCC-DRAM5) U1.72(VCC-DRAM6) U1.79(VCC-DRAM7)
3V0: 3V0.1 C22.1 C47.1 C48.1 C83.1 U1.76(VCC-PLL) U1.115(AVCC) U9.5(OUT)
3V3: 3V1.1 3V3.1 C1.1 C2.1 C14.1 C15.1 C16.1 C17.1 C18.1 C19.1 C20.1 C21.1 C73.1 C82.1 CARD1.4(VDD) H1.5 H1.16 H1.34 H1.36 L1.1 L5.1 P1.22 R1.2 R13.2 R14.2 R15.2 R16.2 R17.2 R19.2 R20.2 R21.2 R22.2 U1.12(VCC-PE0) U1.29(VCC-PE1) U1.50(VCC-IO3) U1.57(VCC-IO2) U1.85(VCC-MCSI) U1.93(EPHY-VCC) U1.98(VCC-RTC) U1.104(VCC-IO0) U1.109(VCC-USB) U1.122(HPVCCIN) U1.127(VCC-IO1) U9.1(IN) U9.3(EN)
+5V: 5V.1 C7.1 C8.1 C9.1 C10.1 C59.1 CN1.19(+5V) H1.1 H1.3 H1.40 U2.7(VIN2) U2.8(EN2) U2.9(EN1) U2.10(VIN1) U2.16(VCC) U2.18(EN3) U2.19(VIN3) U6.2(OUT)
AVCC12: AV.1 C60.1 C61.1 C72.1 L4.2 U8.60(AVCC12) U8.66(AVCC12)
GND: C2.2 C4.2 C6.2 C7.2 C8.2 C9.2 C10.2 C14.2 C15.2 C16.2 C17.2 C18.2 C19.2 C20.2 C21.2 C22.2 C23.2 C24.2 C25.2 C26.2 C27.2 C28.2 C29.2 C30.2 C31.2 C32.2 C33.2 C34.2 C37.2 C38.2 C39.2 C40.2 C41.2 C42.2 C43.2 C44.2 C45.2 C46.2 C47.2 C48.2 C49.2 C50.2 C52.2 C53.1 C54.2 C55.2 C56.2 C58.2 C59.2 C60.2 C61.2 C62.2 C63.2 C64.2 C65.2 C66.2 C67.2 C68.2 C69.2 C70.2 C71.2 C72.2 C73.2 C74.2 C82.2 C83.2 CARD1.6(VSS) CARD1.10(GND) CN1.4(TMDS_DATA2_SHIELD) CN1.7(TMDS_DATA1_SHIELD) CN1.10(TMDS_DATA0_SHIELD) CN1.13(TMDS_CLK_SHIELD) CN1.16(DDC/CEC_GND) CN1.20(SHIELD) CN1.21(SHIELD) CN1.22(SHIELD) CN1.23(SHIELD) D5.3(GND) D5.8(GND) D6.3(GND) D6.8(GND) D7.3(GND) D7.8(GND) D8.3(GND) D8.8(GND) GND.1 GND1.1 H1.2 H1.4 H1.6 H1.15 H1.32 H1.38 P1.1 P1.4 P1.7 P1.10 P1.13 P1.16 P1.19 R2.2 R4.2 R6.2 R8.2 R9.1 R11.1 R23.2 R24.2 R25.2 R26.1 R27.1 U1.116(AGND) U1.129(EGND) U2.1(GND3) U2.4(GND2) U2.5(GND2) U2.12(GND1) U2.13(GND1) U2.15(AGND) U2.17(AGND) U2.21(PAD) U6.1(GND) U8.43(CGND) U8.55(RSVDL) U8.57(IOGND) U8.63(AGND) U8.69(IO_SEL) U8.70(VDDQ) U8.73(EP) U9.2(GND) USB1.1(SHELL) USB1.2(SHELL) USB1.3(SHELL) USB1.4(SHELL) USB1.A1B12(GND) USB1.B1A12(GND) X4.2(GND) X4.4(GND)
VBUS: C58.1 U6.3(IN) USB1.A4B9(VBUS) USB1.B4A9(VBUS) VBUS.1
CAM_IO0: H1.7 P1.17 U1.53(PC1/SDC2_CMD/SPI_CLK)
CAM_IO1: H1.8 P1.18 U1.52(PC0/SDC2_CLK/SPI_MISO)
CAM_SCL: H1.11 P1.20 U1.48(PB8/TWI1_SCK/UART0_TX/PB_EINT8)
CAM_SDA: H1.12 P1.21 U1.49(PB9/TWI1_SDA/UART0_RX/PB_EINT9)
CEC: CN1.15(CEC) U8.71(CEC_A)
CLK: CARD1.5(CLK) CLK.1 R18.1
CVCC12: C62.1 C63.1 C64.1 C65.1 C66.1 C67.1 CV.1 L6.2 U8.5(CVCC12) U8.12(CVCC12) U8.26(CVCC12) U8.42(CVCC12) U8.47(CVCC12) U8.53(CVCC12)
DM: R37.2 U1.110(USB-DM)
DP: R36.2 U1.111(USB-DP)
DSCL: CN1.17(SCL) R22.1 U8.49(DSCL)
DSDA: CN1.18(SDA) R21.1 U8.48(DSDA)
EPHY-RTX: H1.30 U1.94(EPHY-RTX)
EPHY-RXN: H1.26 U1.89(EPHY-RXN)
EPHY-RXP: H1.25 U1.90(EPHY-RXP)
EPHY-TXN: H1.28 U1.91(EPHY-TXN)
EPHY-TXP: H1.27 U1.92(EPHY-TXP)
EPHY_LINK_LED: H1.24 U1.77(EPHY-LINK-LED)
EPHY_SPD_LED: H1.23 U1.78(EPHY-SPD-LED)
ESD_D+: D7.5(IN4) D7.6(NC) D+.1 R37.1 USB1.A7(DN1) USB1.B7(DN2)
ESD_D-: D7.4(IN3) D7.7(NC) D-.1 R36.1 USB1.A6(DP1) USB1.B6(DP2)
HPD: CN1.1(HOT_PLUG_DET) R24.1 U8.54(HPD)
INT: U8.52(INT)
IOVCC: C68.1 C69.1 C70.1 IOV.1 L5.2 U8.3(IOVCC) U8.21(IOVCC) U8.46(IOVCC)
LCD_CLK: U1.37(PE0/CSI_PCLK/LCD_CLK) U8.22(IDCK)
LCD_D2: U1.33(PE4/CSI_D0/LCD_D2) U8.30(D2)
LCD_D3: U1.32(PE5/CSI_D1/LCD_D3) U8.29(D3)
LCD_D4: U1.31(PE6/CSI_D2/LCD_D4) U8.28(D4)
LCD_D5: U1.30(PE7/CSI_D3/LCD_D5) U8.27(D5)
LCD_D6: U1.28(PE8/CSI_D4/LCD_D6) U8.25(D6)
LCD_D7: U1.27(PE9/CSI_D5/LCD_D7) U8.24(D7)
LCD_D10: U1.24(PE10/CSI_D6/LCD_D10) U8.19(D10)
LCD_D11: U1.23(PE11/CSI_D7/LCD_D11) U8.18(D11)
LCD_D12: U1.22(PE12/CSI_D8/LCD_D12) U8.17(D12)
LCD_D13: U1.18(PE13/CSI_D9/LCD_D13) U8.16(D13)
LCD_D14: U1.17(PE14/CSI_D10/LCD_D14) U8.15(D14)
LCD_D15: U1.16(PE15/CSI_D11/LCD_D15) U8.14(D15)
LCD_D18: U1.15(PE16/CSI_D12/LCD_D18) U8.10(D18)
LCD_D19: U1.14(PE17/CSI_D13/LCD_D19) U8.9(D19)
LCD_D20: U1.13(PE18/CSI_D14/LCD_D20) U8.8(D20)
LCD_D21: U1.11(PE19/CSI_D15/LCD_D21) U8.7(D21)
LCD_D22: U1.7(PE23/LCD_D22) U8.6(D22)
LCD_D23: U1.6(PE24/LCD_D23) U8.4(D23)
LCD_DE: U1.36(PE1/CSI_MCLK/LCD_DE) U8.33(DE)
LCD_HSYNC: U1.35(PE2/CSI_HSYNC/LCD_HSYNC) U8.34(HSYNC)
LCD_SCK: R19.1 U1.9(PE21/CSI_SCK/TWI1_SCK/UART1_TX) U8.1(CSCL)
LCD_SDA: R20.1 U1.8(PE22/CSI_SDA/TWI1_SDA/UART1_RX) U8.2(CSDA)
LCD_VSYNC: U1.34(PE3/CSI_VSYNC/LCD_VSYNC) U8.35(VSYNC)
MCSI-CKN: P1.8 U1.87(MCSI-CKN)
MCSI-CKP: P1.9 U1.86(MCSI-CKP)
MCSI-D0N: P1.2 U1.82(MCSI-D0N)
MCSI-D0P: P1.3 U1.81(MCSI-D0P)
MCSI-D1N: P1.5 U1.84(MCSI-D1N)
MCSI-D1P: P1.6 U1.83(MCSI-D1P)
PF6: U1.100(PF6)
PWM0: H1.21 U1.43(PB4/PWM0/PB_EINT4)
PWM1: H1.22 U1.44(PB5/PWM1/PB_EINT5)
RESET: U8.51(RESET#)
RTC_RST: RST.1 U1.99(RESET)
SDC0_CLK: D5.5(IN4) D5.6(NC) R18.2 U1.105(PF2/SDC0_CLK/UART0_TX)
SDC0_CMD: CARD1.3(CMD) CMD.1 D5.4(IN3) D5.7(NC) R15.1 U1.103(PF3/SDC0_CMD/JTAG_DO1)
SDC0_D0: CARD1.7(DAT0) D0.1 D7.1(IN1) D7.10(NC) R16.1 U1.106(PF1/SDC0_D0/JTAG_DI1)
SDC0_D1: CARD1.8(DAT1) D1.1 D7.2(IN2) D7.9(NC) R17.1 U1.107(PF0/SDC0_D1/JTAG_MS1)
SDC0_D2: CARD1.1(DAT2) D2.1 D5.1(IN1) D5.10(NC) R13.1 U1.101(F5/SDC0_D2/JTAG_CK1)
SDC0_D3: CARD1.2(CD/DAT3) D3.1 D5.2(IN2) D5.9(NC) R14.1 U1.102(PF4/SDC0_D3/UART0_RX)
SDC_CLK: H1.29 U1.5(PG0/SDC1_CLK/PG_EINT0)
SDC_CMD: H1.31 U1.4(PG1/SDC1_CMD/PG_EINT1)
SDC_D0: H1.33 U1.3(PG2/SDC1_D0/PG_EINT2)
SDC_D1: H1.35 U1.2(PG3/SDC1_D1/PG_EINT3)
SDC_D2: H1.37 U1.1(PG4/SDC1_D2/PG_EINT4)
SDC_D3: H1.39 U1.128(PG5/SDC1_D3/PG_EINT5)
SPI_CS: H1.10 U1.54(PC2/SDC2_RST/SPI_CS)
SPI_MOSI: H1.9 U1.55(PC3/SDC2_D0/SPI_MOSI)
SVREF: C51.2 C52.1 R10.1 R11.2 U1.63(SVREF1) U1.71(SVREF0)
TWI0_SCK: H1.13 U1.45(PB6/TWI0_SCK/PB_EINT6)
TWI0_SDA: H1.14 U1.46(PB7/TWI0_SDA/PB_EINT7)
TX0+: CN1.9(TMDS_DATA0+) D6.5(IN4) D6.6(NC) U8.62(TX0+)
TX0-: CN1.11(TMDS_DATA0-) D6.4(IN3) D6.7(NC) U8.61(TX0-)
TX1+: CN1.6(TMDS_DATA1+) D8.2(IN2) D8.9(NC) U8.65(TX1+)
TX1-: CN1.8(TMDS_DATA1-) D8.1(IN1) D8.10(NC) U8.64(TX1-)
TX2+: CN1.3(TMDS_DATA2+) D8.5(IN4) D8.6(NC) U8.68(TX2+)
TX2-: CN1.5(TMDS_DATA2-) D8.4(IN3) D8.7(NC) U8.67(TX2-)
TXC+: CN1.12(TMDS_CLK+) D6.2(IN2) D6.9(NC) U8.59(TXC+)
TXC-: CN1.14(TMDS_CLK-) D6.1(IN1) D6.10(NC) U8.58(TXC-)
UART2_CTS: H1.20 U1.42(PB3/UART2_CTS/PB_EINT3)
UART2_RTS: H1.19 U1.41(PB2/UART2_RTS/PB_EINT2)
UART2_RX: H1.18 U1.40(PB1/UART2_RX/PB_EINT1)
UART2_TX: H1.17 U1.39(PB0/UART2_TX/PB_EINT0)
VHP_BP: C44.1 C45.1 U1.123(HPVCCBP)
VRA1: C50.1 U1.117(VRA1)
VRA2: C49.1 R9.2 U1.118(VRA2)
VRTCIO: C46.1 U1.97(RTC-VIO)
X24MIN: C54.1 U1.75(X24MIN) X4.3(OSC2)
X24MOUT: C53.2 U1.74(X24MOUT) X4.1(OSC1)
X32KIN: C55.1 R12.2 U1.96(X32KIN) X3.1
X32KOUT: C56.1 R12.1 U1.95(X32KOUT) X3.2
$1N2220: R8.1 U1.73(SZQ)
$2N330: L1.2 U2.11(LX1)
$2N455: C1.2 R1.1 R2.1 U2.14(FB1)
$2N831: C3.2 R3.1 R4.1 U2.3(FB2)
$2N841: L2.2 U2.6(LX2)
$2N990: C5.2 R5.1 R6.1 U2.2(FB3)
$2N1000: L3.2 U2.20(LX3)
$3N5314: R23.1 U8.56(EXT_SWING)
$3N5640: R25.1 U8.72(CI2CA)
$3N9058: R26.2 USB1.A5(CC1)
$3N9060: R27.2 USB1.B5(CC2)

Not connected (* = marked no-connect by the designer): CARD1 9(CD)* 11(SHELL) 12(SHELL) 13(SHELL) 14(SHELL) 15(SHELL) 16(SHELL) 17(SHELL) 18(SHELL); CN1 2(UTILITY)*; P1 11* 12* 14* 15* 23* 24*; SCREW1 1; SCREW2 1; SCREW3 1; SCREW4 1; U1 10(PE20/CSI_FIELD/CSI_MIPI_MCLK) 112(LRADC0) 113(MICIN1P) 114(MICIN1N) 119(HBIAS) 120(HPOUTR) 121(HPOUTL) 124(HPCOMFB) 125(HPCOM); U8 11(D17)* 13(D16)* 20(D9)* 23(D8)* 31(D1)* 32(D0)* 36(SPDIF)* 37(SD3)* 38(MCLK)* 39(SD2)* 40(SD1)* 41(SD0)* 44(WS)* 45(SCK)* 50(CEC_D)*; U9 4(N/C)*; USB1 A8(SBU1)* B8(SBU2)*

## Notes on the sheets
sheet 2
- Power Rails
- USB Inrush Limiter
- PMIC
- Decoupling
- Filtered Power Rails For HDMI
- LDO
sheet 3
- SD CARD (SDC_0)
- USB-C
- ESD
- RGB To HDMI
- Micro HDMI Receptacle
- 22 Pin CSI
- 1%
- GPIO Headers
